# EAGLE design THS788_carrier (EAGLE 9.1.2)
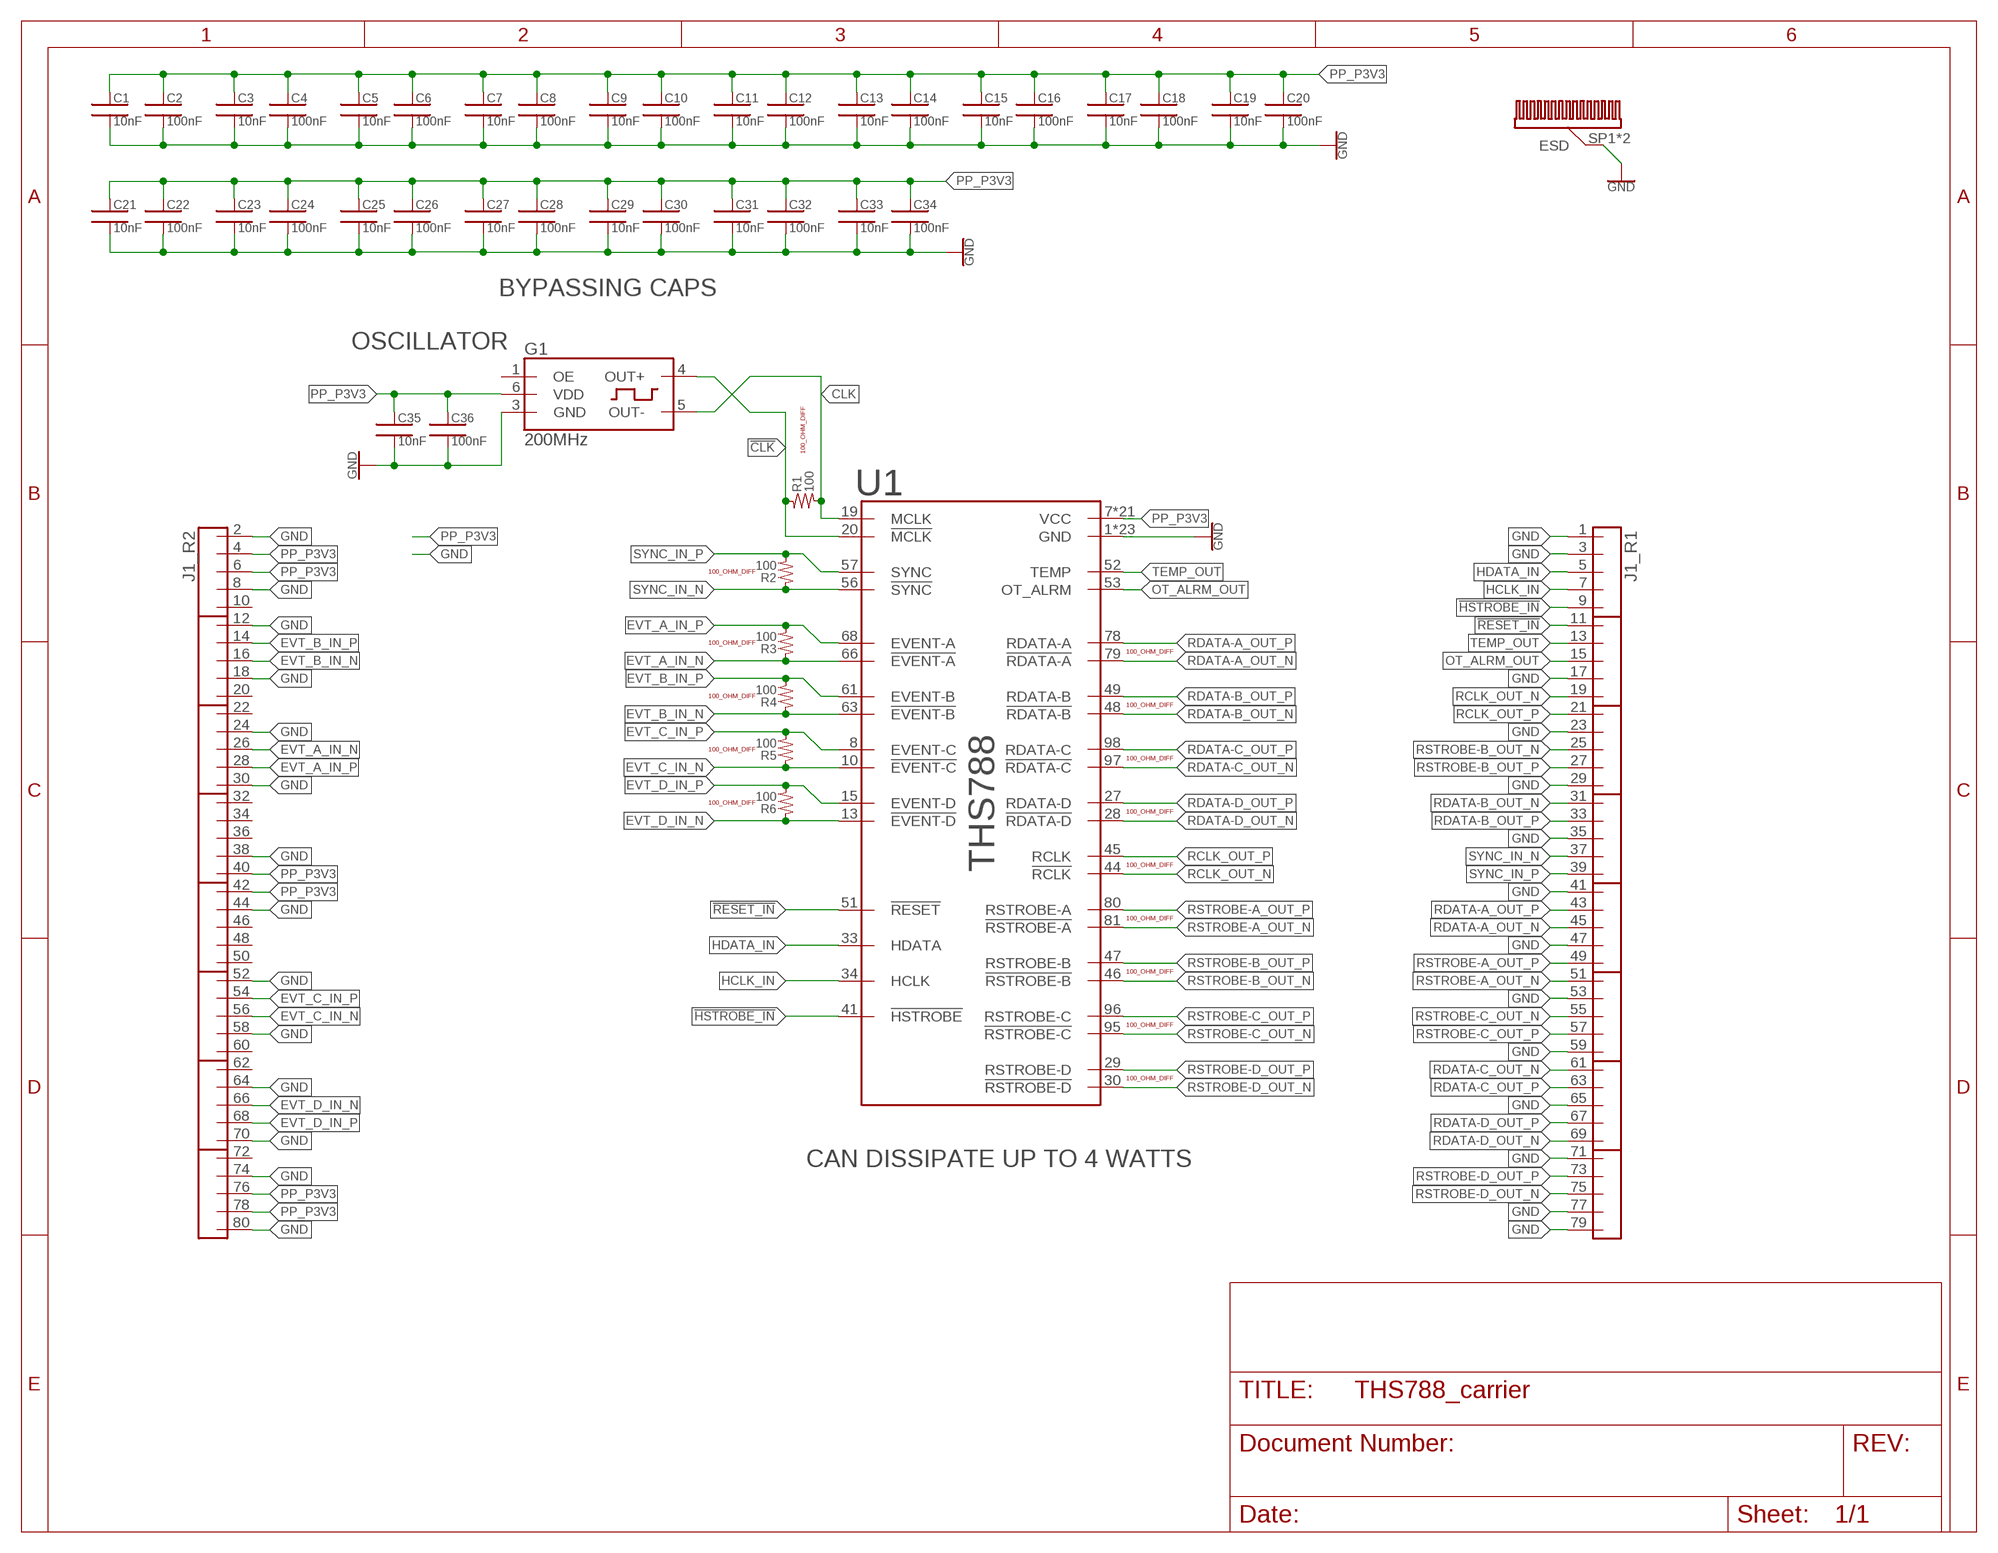
[diagram p0: schematic, sheet 1]

## Parts
C1  10nF  CAP_0402  [0402]
C2  100nF  CAP_0402  [0402]
C3  10nF  CAP_0402  [0402]
C4  100nF  CAP_0402  [0402]
C5  10nF  CAP_0402  [0402]
C6  100nF  CAP_0402  [0402]
C7  10nF  CAP_0402  [0402]
C8  100nF  CAP_0402  [0402]
C9  10nF  CAP_0402  [0402]
C10  100nF  CAP_0402  [0402]
C11  10nF  CAP_0402  [0402]
C12  100nF  CAP_0402  [0402]
C13  10nF  CAP_0402  [0402]
C14  100nF  CAP_0402  [0402]
C15  10nF  CAP_0402  [0402]
C16  100nF  CAP_0402  [0402]
C17  10nF  CAP_0402  [0402]
C18  100nF  CAP_0402  [0402]
C19  10nF  CAP_0402  [0402]
C20  100nF  CAP_0402  [0402]
C21  10nF  CAP_0402  [0402]
C22  100nF  CAP_0402  [0402]
C23  10nF  CAP_0402  [0402]
C24  100nF  CAP_0402  [0402]
C25  10nF  CAP_0402  [0402]
C26  100nF  CAP_0402  [0402]
C27  10nF  CAP_0402  [0402]
C28  100nF  CAP_0402  [0402]
C29  10nF  CAP_0402  [0402]
C30  100nF  CAP_0402  [0402]
C31  10nF  CAP_0402  [0402]
C32  100nF  CAP_0402  [0402]
C33  10nF  CAP_0402  [0402]
C34  100nF  CAP_0402  [0402]
C35  10nF  CAP_0402  [0402]
C36  100nF  CAP_0402  [0402]
G1  200MHz  SIT5021  [SIT5021_5X3.2]
HTSINK1  ATS_HEATSINK  [ATS-FPX025025010-43-C2-R0]
J1  BXE-040-01-F-D-A_BSE  [BSE-040-01-F-D-A]
R1  100  RES_0402  [0402]
R2  100  RES_0402  [0402]
R3  100  RES_0402  [0402]
R4  100  RES_0402  [0402]
R5  100  RES_0402  [0402]
R6  100  RES_0402  [0402]
U1  THS788  [S-QFP-G100]

## Nets
!CLK!: G1.4(OUT+) R1.1 U1.20(!MCLK)
!HSTROBE_IN: J1.9(_R1:P5) U1.41(!HSTROBE)
!RESET_IN: J1.11(_R1:P6) U1.51(!RESET)
CLK: G1.5(OUT-) R1.2 U1.19(MCLK)
EVT_A_IN_N [100_OHM_DIFF]: J1.26(_R2:P13) R3.1 U1.66(!EVENT-A)
EVT_A_IN_P [100_OHM_DIFF]: J1.28(_R2:P14) R3.2 U1.68(EVENT-A)
EVT_B_IN_N [100_OHM_DIFF]: J1.16(_R2:P8) R4.1 U1.63(!EVENT-B)
EVT_B_IN_P [100_OHM_DIFF]: J1.14(_R2:P7) R4.2 U1.61(EVENT-B)
EVT_C_IN_N [100_OHM_DIFF]: J1.56(_R2:P28) R5.1 U1.10(!EVENT-C)
EVT_C_IN_P [100_OHM_DIFF]: J1.54(_R2:P27) R5.2 U1.8(EVENT-C)
EVT_D_IN_N [100_OHM_DIFF]: J1.66(_R2:P33) R6.1 U1.13(!EVENT-D)
EVT_D_IN_P [100_OHM_DIFF]: J1.68(_R2:P34) R6.2 U1.15(EVENT-D)
GND: C1.2 C2.2 C3.2 C4.2 C5.2 C6.2 C7.2 C8.2 C9.2 C10.2 C11.2 C12.2 C13.2 C14.2 C15.2 C16.2 C17.2 C18.2 C19.2 C20.2 C21.2 C22.2 C23.2 C24.2 C25.2 C26.2 C27.2 C28.2 C29.2 C30.2 C31.2 C32.2 C33.2 C34.2 C35.2 C36.2 G1.3(GND) HTSINK1.SP1(ESD) HTSINK1.SP2(ESD) J1.1(_R1:P1) J1.2(_R2:P1) J1.3(_R1:P2) J1.8(_R2:P4) J1.12(_R2:P6) J1.17(_R1:P9) J1.18(_R2:P9) J1.23(_R1:P12) J1.24(_R2:P12) J1.29(_R1:P15) J1.30(_R2:P15) J1.35(_R1:P18) J1.38(_R2:P19) J1.41(_R1:P21) J1.44(_R2:P22) J1.47(_R1:P24) J1.52(_R2:P26) J1.53(_R1:P27) J1.58(_R2:P29) J1.59(_R1:P30) J1.64(_R2:P32) J1.65(_R1:P33) J1.70(_R2:P35) J1.71(_R1:P36) J1.74(_R2:P37) J1.77(_R1:P39) J1.79(_R1:P40) J1.80(_R2:P40) U1.1(GND) U1.2(GND) U1.11(GND) U1.12(GND) U1.21(GND) U1.25(GND) U1.32(GND) U1.35(GND) U1.37(GND) U1.39(GND) U1.42(GND) U1.55(GND) U1.64(GND) U1.65(GND) U1.74(GND) U1.75(GND) U1.82(GND) U1.84(GND) U1.85(GND) U1.87(GND) U1.89(GND) U1.92(GND) U1.94(GND)
HCLK_IN: J1.7(_R1:P4) U1.34(HCLK)
HDATA_IN: J1.5(_R1:P3) U1.33(HDATA)
OT_ALRM_OUT: J1.15(_R1:P8) U1.53(OT_ALRM)
PP_P3V3: C1.1 C2.1 C3.1 C4.1 C5.1 C6.1 C7.1 C8.1 C9.1 C10.1 C11.1 C12.1 C13.1 C14.1 C15.1 C16.1 C17.1 C18.1 C19.1 C20.1 C21.1 C22.1 C23.1 C24.1 C25.1 C26.1 C27.1 C28.1 C29.1 C30.1 C31.1 C32.1 C33.1 C34.1 C35.1 C36.1 G1.6(VDD) J1.4(_R2:P2) J1.6(_R2:P3) J1.40(_R2:P20) J1.42(_R2:P21) J1.76(_R2:P38) J1.78(_R2:P39) U1.7(VCC) U1.16(VCC) U1.22(VCC) U1.23(VCC) U1.24(VCC) U1.31(VCC) U1.36(VCC) U1.38(VCC) U1.40(VCC) U1.43(VCC) U1.58(VCC) U1.60(VCC) U1.69(VCC) U1.77(VCC) U1.83(VCC) U1.86(VCC) U1.88(VCC) U1.90(VCC) U1.91(VCC) U1.93(VCC) U1.99(VCC)
RCLK_OUT_N [100_OHM_DIFF]: J1.19(_R1:P10) U1.44(!RCLK)
RCLK_OUT_P [100_OHM_DIFF]: J1.21(_R1:P11) U1.45(RCLK)
RDATA-A_OUT_N [100_OHM_DIFF]: J1.45(_R1:P23) U1.79(!RDATA-A)
RDATA-A_OUT_P [100_OHM_DIFF]: J1.43(_R1:P22) U1.78(RDATA-A)
RDATA-B_OUT_N [100_OHM_DIFF]: J1.31(_R1:P16) U1.48(!RDATA-B)
RDATA-B_OUT_P [100_OHM_DIFF]: J1.33(_R1:P17) U1.49(RDATA-B)
RDATA-C_OUT_N [100_OHM_DIFF]: J1.61(_R1:P31) U1.97(!RDATA-C)
RDATA-C_OUT_P [100_OHM_DIFF]: J1.63(_R1:P32) U1.98(RDATA-C)
RDATA-D_OUT_N [100_OHM_DIFF]: J1.69(_R1:P35) U1.28(!RDATA-D)
RDATA-D_OUT_P [100_OHM_DIFF]: J1.67(_R1:P34) U1.27(RDATA-D)
RSTROBE-A_OUT_N [100_OHM_DIFF]: J1.51(_R1:P26) U1.81(!RSTROBE-A)
RSTROBE-A_OUT_P [100_OHM_DIFF]: J1.49(_R1:P25) U1.80(RSTROBE-A)
RSTROBE-B_OUT_N [100_OHM_DIFF]: J1.25(_R1:P13) U1.46(!RSTROBE-B)
RSTROBE-B_OUT_P [100_OHM_DIFF]: J1.27(_R1:P14) U1.47(RSTROBE-B)
RSTROBE-C_OUT_N [100_OHM_DIFF]: J1.55(_R1:P28) U1.95(!RSTROBE-C)
RSTROBE-C_OUT_P [100_OHM_DIFF]: J1.57(_R1:P29) U1.96(RSTROBE-C)
RSTROBE-D_OUT_N [100_OHM_DIFF]: J1.75(_R1:P38) U1.30(!RSTROBE-D)
RSTROBE-D_OUT_P [100_OHM_DIFF]: J1.73(_R1:P37) U1.29(RSTROBE-D)
SYNC_IN_N [100_OHM_DIFF]: J1.37(_R1:P19) R2.1 U1.56(!SYNC)
SYNC_IN_P [100_OHM_DIFF]: J1.39(_R1:P20) R2.2 U1.57(SYNC)
TEMP_OUT: J1.13(_R1:P7) U1.52(TEMP)
Unconnected: G1.1(OE) J1.10(_R2:P5) J1.20(_R2:P10) J1.22(_R2:P11) J1.32(_R2:P16) J1.34(_R2:P17) J1.36(_R2:P18) J1.46(_R2:P23) J1.48(_R2:P24) J1.50(_R2:P25) J1.60(_R2:P30) J1.62(_R2:P31) J1.72(_R2:P36)

## Notes on the sheet
- BYPASSING CAPS
- OSCILLATOR
- 100_OHM_DIFF
- 100_OHM_DIFF
- 100_OHM_DIFF
- 100_OHM_DIFF
- 100_OHM_DIFF
- 100_OHM_DIFF
- 100_OHM_DIFF
- 100_OHM_DIFF
- 100_OHM_DIFF
- 100_OHM_DIFF
- 100_OHM_DIFF
- 100_OHM_DIFF
- 100_OHM_DIFF
- 100_OHM_DIFF
- 100_OHM_DIFF
- CAN DISSIPATE UP TO 4 WATTS

## Library data of the parts
C1-C36 = tcspc_lib:CAP
G1 = tcspc_lib:SIT5021: SiT5021 Oscillator 1-220 MHz High Performance Differential (VC) TCXO https://www.digikey.com/product-detail/en/sitime/SIT5021AC-2CE-33E-200.000000X/1473-30172-1-ND/7347769
HTSINK1 = tcspc_lib:ATS_HEATSINK
J1 = tcspc_lib:BXE-040-01-F-D-A
R1-R6 = tcspc_lib:RES
U1 = tcspc_lib:THS788: THS788 Quad-Channel Time Measurement Unit http://www.ti.com/lit/ds/symlink/ths788.pdf

## Net classes
1 50_OHM_SE: width 0.203 mm
2 100_OHM_DIFF: width 0.152 mm, clearance 0.29 mm

## Board
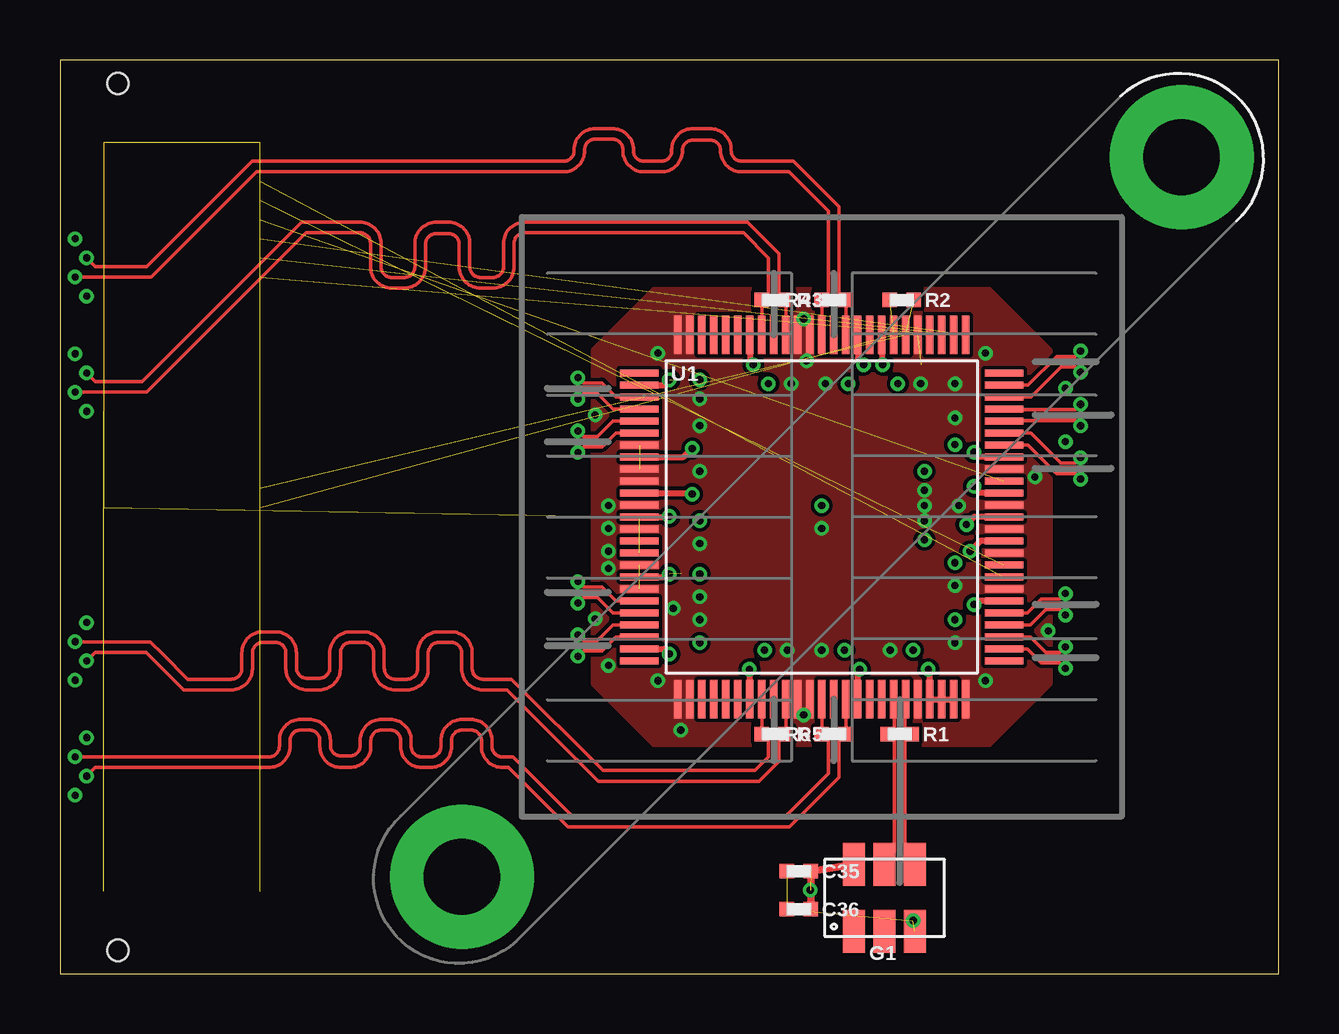
[diagram p1: board, top side]
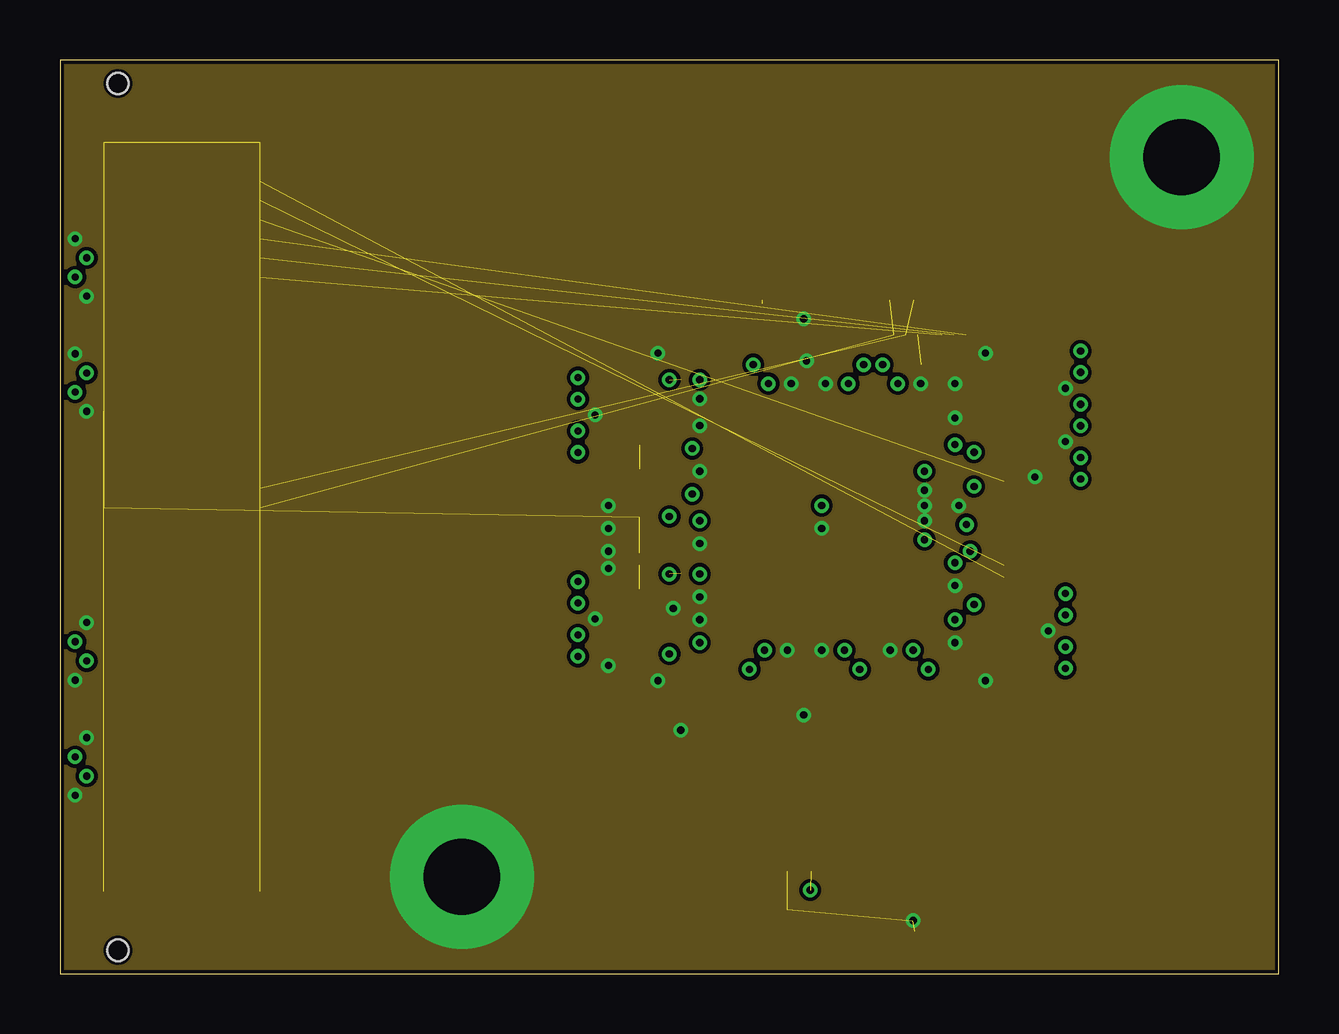
[diagram p2: board, inner layer Route2]
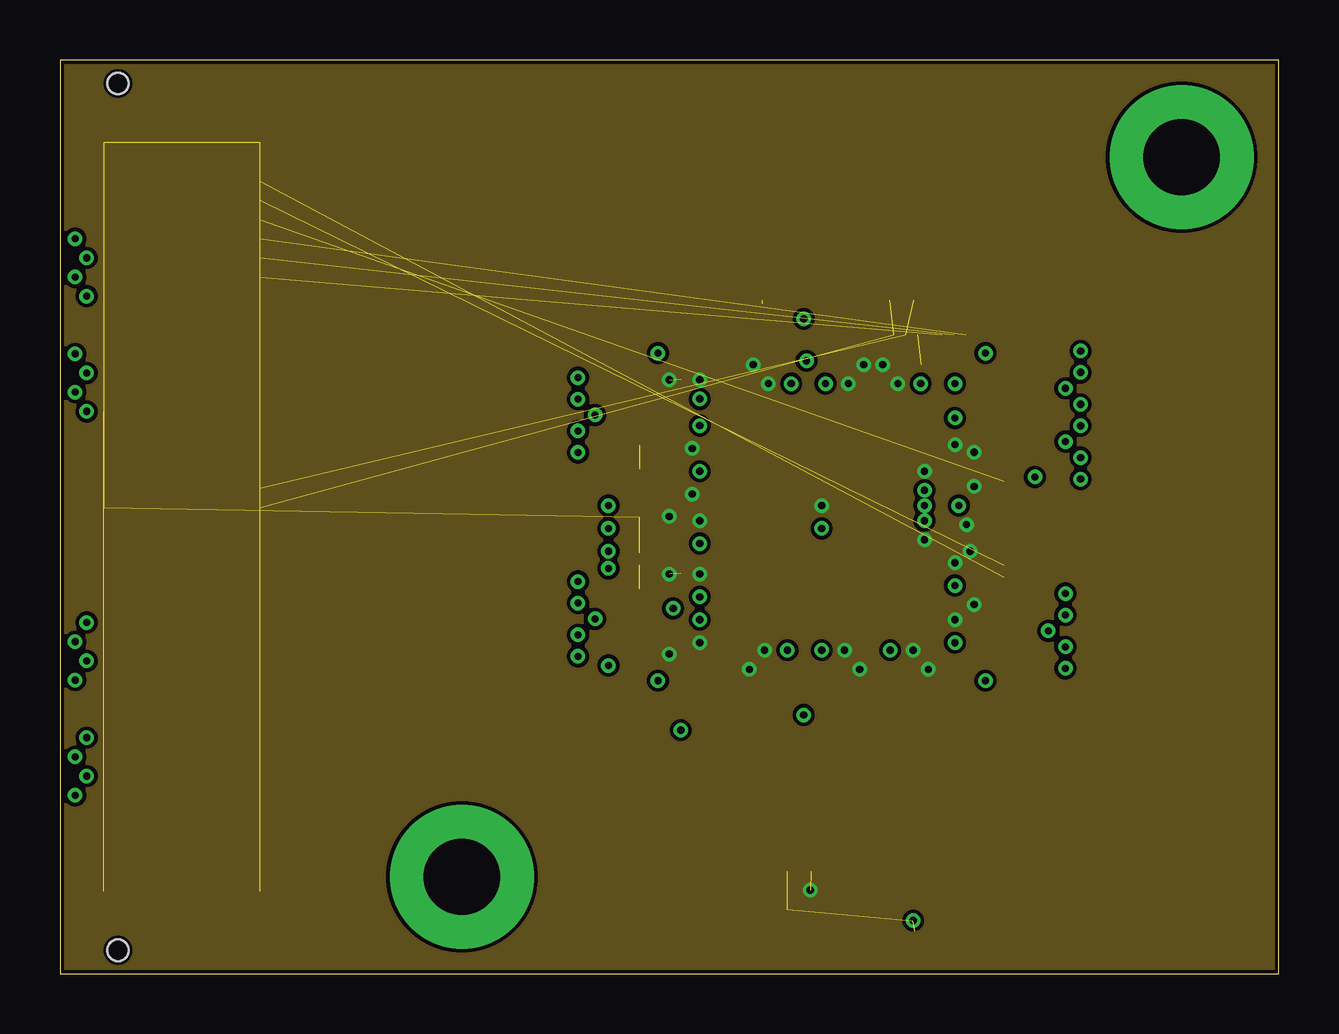
[diagram p3: board, inner layer Route15]
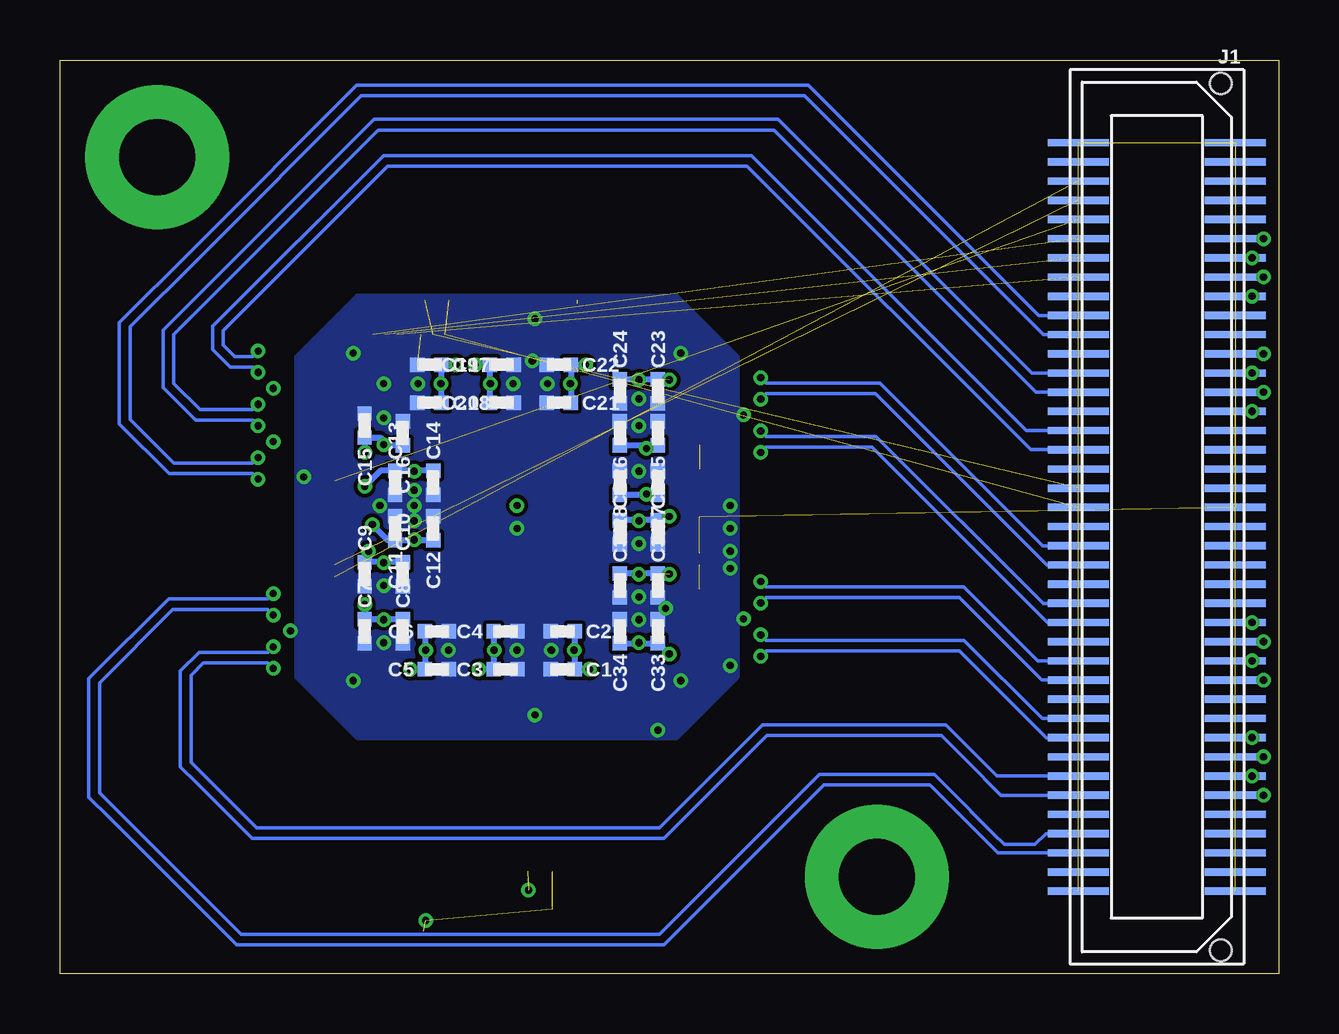
[diagram p4: board, bottom side, seen from below]

Size 50.8 x 38.1 mm. Coordinates in mm from the lower left corner, seen from the top.
Outline: 0,0 50.8,0 50.8,38.1 0,38.1 0,0
Copper layers (1+2*15+16): Top 0.035mm / dielectric 1.5mm / Route2 0.035mm / dielectric 0.15mm / Route15 0.035mm / dielectric 0.2mm / Bottom 0.035mm
Design rules "3PCB_4layer": minimum track width 6mil, minimum drill 0.3mm, track to track 6mil, track to pad 6mil, pad to pad 6mil, via to via 6mil, smd to smd 0mil, copper to edge 6mil, drill to drill 6mil, minimum pad ring 6mil, minimum via ring 6mil, stop-mask expansion 2mil, vias tented up to drill 0.3mm, thermal gap 10mil

### Footprints (pad centres in the part's own frame; a part is rotated, then mirrored left to right if it is on the bottom)
0402 = smd 0.6 x 0.6: 1 -0.5,0; 2 0.5,0
SIT5021_5X3.2 = smd 0.9 x 1.8: 1 -1.27,-1.4; 2 0,-1.4; 3 1.27,-1.4; 4 1.27,1.4; 5 0,1.4; 6 -1.27,1.4
ATS-FPX025025010-43-C2-R0 = drill 3.175 pad 6: SP1 -15,-15; SP2 15,15
BSE-040-01-F-D-A = smd 0.305 x 2.54: 1 -15.602,-3.264; 2 -15.602,3.264; 3 -14.802,-3.264; 4 -14.802,3.264; 5 -14.002,-3.264; 6 -14.002,3.264; 7 -13.202,-3.264; 8 -13.202,3.264; 9 -12.402,-3.264; 10 -12.402,3.264; 11 -11.601,-3.264; 12 -11.601,3.264; 13 -10.801,-3.264; 14 -10.801,3.264; 15 -10.001,-3.264; 16 -10.001,3.264; 17 -9.201,-3.264; 18 -9.201,3.264; 19 -8.401,-3.264; 20 -8.401,3.264; 21 -7.601,-3.264; 22 -7.601,3.264; 23 -6.801,-3.264; 24 -6.801,3.264; 25 -6.001,-3.264; 26 -6.001,3.264; 27 -5.201,-3.264; 28 -5.201,3.264; 29 -4.401,-3.264; 30 -4.401,3.264; 31 -3.6,-3.264; 32 -3.6,3.264; 33 -2.8,-3.264; 34 -2.8,3.264; 35 -2,-3.264; 36 -2,3.264; 37 -1.2,-3.264; 38 -1.2,3.264; 39 -0.4,-3.264; 40 -0.4,3.264; 41 0.4,-3.264; 42 0.4,3.264; 43 1.2,-3.264; 44 1.2,3.264; 45 2,-3.264; 46 2,3.264; 47 2.8,-3.264; 48 2.8,3.264; 49 3.6,-3.264; 50 3.6,3.264; 51 4.401,-3.264; 52 4.401,3.264; 53 5.201,-3.264; 54 5.201,3.264; 55 6.001,-3.264; 56 6.001,3.264; 57 6.801,-3.264; 58 6.801,3.264; 59 7.601,-3.264; 60 7.601,3.264; 61 8.401,-3.264; 62 8.401,3.264; 63 9.201,-3.264; 64 9.201,3.264; 65 10.001,-3.264; 66 10.001,3.264; 67 10.801,-3.264; 68 10.801,3.264; 69 11.601,-3.264; 70 11.601,3.264; 71 12.402,-3.264; 72 12.402,3.264; 73 13.202,-3.264; 74 13.202,3.264; 75 14.002,-3.264; 76 14.002,3.264; 77 14.802,-3.264; 78 14.802,3.264; 79 15.602,-3.264; 80 15.602,3.264 | hole 0.889: -18.066,2.667; 18.066,2.667
S-QFP-G100 = smd 0.3 x 1.6: 1 -6,-7.6; 2 -5.5,-7.6; 3 -5,-7.6; 4 -4.5,-7.6; 5 -4,-7.6; 6 -3.5,-7.6; 7 -3,-7.6; 8 -2.5,-7.6; 9 -2,-7.6; 10 -1.5,-7.6; 11 -1,-7.6; 12 -0.5,-7.6; 13 0,-7.6; 14 0.5,-7.6; 15 1,-7.6; 16 1.5,-7.6; 17 2,-7.6; 18 2.5,-7.6; 19 3,-7.6; 20 3.5,-7.6; 21 4,-7.6; 22 4.5,-7.6; 23 5,-7.6; 24 5.5,-7.6; 25 6,-7.6; 51 6,7.6; 52 5.5,7.6; 53 5,7.6; 54 4.5,7.6; 55 4,7.6; 56 3.5,7.6; 57 3,7.6; 58 2.5,7.6; 59 2,7.6; 60 1.5,7.6; 61 1,7.6; 62 0.5,7.6; 63 0,7.6; 64 -0.5,7.6; 65 -1,7.6; 66 -1.5,7.6; 67 -2,7.6; 68 -2.5,7.6; 69 -3,7.6; 70 -3.5,7.6; 71 -4,7.6; 72 -4.5,7.6; 73 -5,7.6; 74 -5.5,7.6; 75 -6,7.6 | smd 1.6 x 0.3: 26 7.6,-6; 27 7.6,-5.5; 28 7.6,-5; 29 7.6,-4.5; 30 7.6,-4; 31 7.6,-3.5; 32 7.6,-3; 33 7.6,-2.5; 34 7.6,-2; 35 7.6,-1.5; 36 7.6,-1; 37 7.6,-0.5; 38 7.6,0; 39 7.6,0.5; 40 7.6,1; 41 7.6,1.5; 42 7.6,2; 43 7.6,2.5; 44 7.6,3; 45 7.6,3.5; 46 7.6,4; 47 7.6,4.5; 48 7.6,5; 49 7.6,5.5; 50 7.6,6; 76 -7.6,6; 77 -7.6,5.5; 78 -7.6,5; 79 -7.6,4.5; 80 -7.6,4; 81 -7.6,3.5; 82 -7.6,3; 83 -7.6,2.5; 84 -7.6,2; 85 -7.6,1.5; 86 -7.6,1; 87 -7.6,0.5; 88 -7.6,0; 89 -7.6,-0.5; 90 -7.6,-1; 91 -7.6,-1.5; 92 -7.6,-2; 93 -7.6,-2.5; 94 -7.6,-3; 95 -7.6,-3.5; 96 -7.6,-4; 97 -7.6,-4.5; 98 -7.6,-5; 99 -7.6,-5.5; 100 -7.6,-6

### Placement (x,y rotation side)
C1  29.84,12.7 180 bottom
C2  29.84,14.29 180 bottom
C3  32.23,12.7 0 bottom
C4  32.23,14.29 0 bottom
C5  35.08,12.7 0 bottom
C6  35.08,14.29 0 bottom
C7  38.1,14.29 270 bottom
C8  36.51,14.29 270 bottom
C9  38.1,16.67 270 bottom
C10  36.51,16.67 270 bottom
C11  36.83,18.57 90 bottom
C12  35.24,18.57 90 bottom
C13  36.83,20.48 270 bottom
C14  35.24,20.48 270 bottom
C15  38.1,22.86 90 bottom
C16  36.51,22.54 90 bottom
C17  35.4,25.4 180 bottom
C18  35.4,23.81 180 bottom
C19  32.38,25.4 0 bottom
C20  32.38,23.81 0 bottom
C21  30,23.81 180 bottom
C22  30,25.4 180 bottom
C23  25.88,24.29 270 bottom
C24  27.46,24.29 270 bottom
C25  25.88,22.54 90 bottom
C26  27.46,22.54 90 bottom
C27  25.88,20.48 90 bottom
C28  27.46,20.48 90 bottom
C29  25.88,18.41 270 bottom
C30  27.46,18.41 270 bottom
C31  25.88,16.19 270 bottom
C32  27.46,16.19 270 bottom
C33  25.88,14.29 90 bottom
C34  27.46,14.29 90 bottom
C35  30.8,4.29 180 top
C36  30.8,2.7 180 top
G1  34.37,3.17 0 top
HTSINK1  31.75,19.05 180 top
J1  5.08,19.05 270 bottom
R1  35,10 180 top
R2  35.08,28.1 180 top
R3  29.75,28.1 180 top
R4  32.25,28.1 0 top
R5  29.75,10 180 top
R6  32.25,10 0 top
U1  31.75,19.05 0 top

### Tracks (layer width: path | path; a pad name or v marks a point on that pad's centre or on a via)
!CLK!
  Top 0.152: 35.22,10 35.22,5.08 G1.4 | 35.22,10 35.22,10.16 35.22,10.48 U1.20 | R1.1 35.22,10
!HSTROBE_IN  (1 unrouted)
!RESET_IN  (1 unrouted)
CLK
  Top 0.152: 34.78,10 34.78,10.48 U1.19 | 34.78,10 34.78,5.08 G1.5 | R1.2 34.78,10
EVT_A_IN_N  (via drill 0.3)
  Top 0.152: U1.66 R3.1 29.97,28.38 29.97,28.89 29.97,30.03 28.67,31.34 19.37,31.34 arc90 18.49,30.46 18.49,29.47 arc-90 18.05,29.03 17.52,29.03 arc-90 17.08,29.47 17.08,30.46 arc90 16.2,31.34 15.67,31.34 arc90 14.79,30.46 14.79,29.47 arc-90 14.35,29.03 13.82,29.03 arc-90 13.39,29.47 13.39,30.46 arc90 12.51,31.34 10.07,31.34 3.43,24.69 1.47,24.69 v1.11,25.05
  Bottom 0.152: J1.26 v1.11,25.05
EVT_A_IN_P  (via drill 0.3)  (1 unrouted)
  Top 0.152: U1.68 29.25,27.94 | R3.2 29.53,28.38 29.53,28.89 29.53,29.85 28.48,30.89 19.37,30.89 arc90 18.93,30.46 18.93,29.47 arc-90 18.05,28.59 17.52,28.59 arc-90 16.64,29.47 16.64,30.42 arc90 16.2,30.86 15.67,30.86 arc90 15.23,30.42 15.23,29.47 arc-90 14.35,28.59 13.82,28.59 arc-90 12.94,29.47 12.94,30.46 arc90 12.51,30.89 10.25,30.89 3.61,24.25 v0.64,24.25
  Bottom 0.152: v0.64,24.25 J1.28
EVT_B_IN_N  (via drill 0.3)
  Top 0.152: U1.63 R4.1 32.03,28.38 32.03,28.89 32.03,31.79 30.39,33.43 28.42,33.43 arc-90 27.54,34.31 27.54,34.32 arc90 27.1,34.76 26.38,34.76 arc90 25.94,34.32 25.94,34.31 arc-90 25.06,33.43 24.34,33.43 arc-90 23.46,34.31 23.46,34.36 arc90 23.02,34.8 22.31,34.8 arc90 21.87,34.36 21.87,34.31 arc-90 20.99,33.43 8.19,33.43 3.81,29.05 v0.64,29.05
  Bottom 0.152: v0.64,29.05 J1.16
EVT_B_IN_P  (via drill 0.3)
  Top 0.152: U1.61 R4.2 32.47,28.38 32.47,28.89 | 32.47,28.89 32.47,31.98 30.57,33.88 28.42,33.88 arc-90 27.98,34.31 27.98,34.36 arc90 27.1,35.24 26.38,35.24 arc90 25.5,34.36 25.5,34.31 arc-90 25.06,33.88 24.34,33.88 arc-90 23.91,34.31 23.91,34.36 arc90 23.02,35.24 22.31,35.24 arc90 21.43,34.36 21.43,34.31 arc-90 20.99,33.88 8.01,33.88 3.62,29.49 1.47,29.49 v1.11,29.85 | 32.47,28.89
  Bottom 0.152: v1.11,29.85 J1.14
EVT_C_IN_N  (via drill 0.3)
  Top 0.152: U1.10 R5.1 29.97,9.72 29.97,8.86 29.14,8.03 22.45,8.03 18.64,11.84 17.62,11.84 arc-90 16.74,12.72 16.74,13.38 arc90 16.3,13.82 15.79,13.82 arc90 15.35,13.38 15.35,12.72 arc-90 14.47,11.84 13.96,11.84 arc-90 13.08,12.72 13.08,13.38 arc90 12.64,13.82 12.13,13.82 arc90 11.69,13.38 11.69,12.72 arc-90 10.81,11.84 10.29,11.84 arc-90 9.41,12.72 9.41,13.38 arc90 8.98,13.82 8.46,13.82 arc90 8.03,13.38 8.03,12.72 arc-90 7.14,11.84 5.15,11.84 3.58,13.41 2.54,13.41 1.47,13.41 v1.11,13.05
  Bottom 0.152: v1.11,13.05 J1.56
EVT_C_IN_P  (via drill 0.3)
  Top 0.152: U1.8 R5.2 29.53,9.72 29.53,9.04 28.96,8.48 22.63,8.48 18.82,12.29 17.62,12.29 arc-90 17.18,12.72 17.18,13.38 arc90 16.3,14.26 15.79,14.26 arc90 14.91,13.38 14.91,12.72 arc-90 14.47,12.29 13.96,12.29 arc-90 13.52,12.72 13.52,13.38 arc90 12.64,14.26 12.13,14.26 arc90 11.25,13.38 11.25,12.76 arc-90 10.81,12.32 10.29,12.32 arc-90 9.86,12.76 9.86,13.38 arc90 8.98,14.26 8.46,14.26 arc90 7.58,13.38 7.58,12.72 arc-90 7.14,12.29 5.33,12.29 4.28,13.33 3.77,13.85 v0.64,13.85
  Bottom 0.152: v0.64,13.85 J1.54
EVT_D_IN_N  (via drill 0.3)
  Top 0.152: U1.13 R6.1 32.03,9.72 32.03,8.37 30.23,6.57 21.36,6.57 18.89,9.05 18.45,9.05 arc-90 18.01,9.49 18.01,9.73 arc90 17.13,10.61 16.76,10.61 arc90 15.88,9.73 15.88,9.49 arc-90 15.44,9.05 15.08,9.05 arc-90 14.64,9.49 14.64,9.73 arc90 13.76,10.61 13.39,10.61 arc90 12.52,9.73 12.52,9.52 arc-90 12.08,9.09 11.71,9.09 arc-90 11.27,9.52 11.27,9.73 arc90 10.39,10.61 10.03,10.61 arc90 9.15,9.73 9.15,9.49 arc-90 8.71,9.05 v0.64,9.05
  Bottom 0.152: v0.64,9.05 J1.66
EVT_D_IN_P  (via drill 0.3)
  Top 0.152: U1.15 R6.2 32.47,9.72 32.47,8.19 30.41,6.13 21.18,6.13 18.7,8.61 18.45,8.61 arc-90 17.57,9.49 17.57,9.73 arc90 17.13,10.17 16.76,10.17 arc90 16.32,9.73 16.32,9.49 arc-90 15.44,8.61 15.08,8.61 arc-90 14.2,9.49 14.2,9.73 arc90 13.76,10.17 13.39,10.17 arc90 12.96,9.73 12.96,9.49 arc-90 12.08,8.61 11.71,8.61 arc-90 10.83,9.49 10.83,9.73 arc90 10.39,10.17 10.03,10.17 arc90 9.59,9.73 9.59,9.49 arc-90 8.71,8.61 1.47,8.61 v1.11,8.25
  Bottom 0.152: v1.11,8.25 J1.68
GND  (via drill 0.3)  (26 unrouted)
  Bottom 0.152: J1.64 v1.11,9.85 | J1.70 v0.64,7.45 | J1.58 v0.64,12.25 | J1.52 v1.11,14.65 | J1.30 v1.11,23.45 | J1.24 v0.64,25.85 | J1.12 v0.64,30.65 | J1.18 v1.11,28.25
  other vias: 31.75,18.57 37.47,19.53 36.04,19.53 36.04,18.89 36.04,20.16 37.31,16.19 37.31,23.18 35.88,24.61 38.58,25.88 38.58,12.22 24.92,12.22 24.92,25.88 37.31,24.61 31.91,24.61 30.48,24.61 26.67,22.86 26.67,23.97 26.67,20.95 26.67,17.94 25.56,15.24 26.67,15.72 26.67,14.76 31.11,25.56 31,27.3 40.64,20.72 37.31,13.81 34.61,13.49 31.75,13.49 30.32,13.49 31,10.79 25.88,10.16 22.86,16.91 22.86,17.62 22.86,19.53 22.86,18.57 35.56,2.22 22.86,12.86 22.3,14.8 22.3,23.3 41.91,22.19 41.2,14.3 41.91,24.41
  pour Top (no thermals): 22.23,12.06 22.23,26.04 24.77,28.57 38.73,28.57 41.27,26.04 41.27,12.06 38.73,9.53 24.77,9.53
  pour Bottom (no thermals): 22.54,12.38 22.54,25.72 25.08,28.26 38.42,28.26 40.96,25.72 40.96,12.38 38.42,9.84 25.08,9.84
  pour Route2: -1.27,52.07 52.07,52.07 52.07,-1.27 -1.27,-1.27
HCLK_IN  (1 unrouted)
HDATA_IN  (1 unrouted)
OT_ALRM_OUT  (1 unrouted)
PP_P3V3  (via drill 0.3, 0.3 pad 0.2)  (11 unrouted)
  Top 0.254: U1.7 28.75,12.68 v28.73,12.7 | U1.16 33.25,12.61 v33.34,12.7 | v36.2,12.7 36.25,12.64 U1.22 U1.23 U1.24 | U1.31 38.25,15.55 v38.1,15.4 | U1.36 38.37,18.05 v37.94,17.62 | U1.38 38.1,19.05 v37.78,18.73 | U1.40 38.37,20.05 v38.1,20.32 | U1.43 38.3,21.55 v38.1,21.75 | U1.58 34.25,25.44 v34.29,25.4 | U1.60 33.25,25.65 v33.5,25.4 | U1.69 28.75,25.54 v28.89,25.4 | U1.77 25.18,24.55 v25.4,24.77 | U1.83 26,21.55 v26.35,21.91 | U1.86 26.3,20.05 v26.35,20 | U1.88 25.38,19.05 v25.4,19.07 | U1.93 25.28,16.55 v25.4,16.67 | U1.99 25.18,13.55 v25.4,13.34
  Top 0.318: G1.6 31.31,4.28 C35.1 C36.1
  Bottom 0.254: C4.1 C3.1 v33.34,12.7 | C2.1 C1.1 v28.73,12.7 | C6.1 C5.1 v36.2,12.7 | v38.1,15.4 C7.1 C8.1 | v37.94,17.62 37.94,17.64 38.1,17.49 C9.1 C10.1 | v37.78,18.73 37.12,18.07 C11.1 C12.1 | v38.1,20.32 37.44,20.98 C13.1 C14.1 | v38.1,21.75 C15.1 37.44,22.36 37.12,22.04 C16.1 | v34.29,25.4 C17.1 C18.1 | v33.5,25.4 C19.1 C20.1 | C21.1 C22.1 v28.89,25.4 | C28.1 26.38,19.98 v26.35,20 26.33,19.98 C27.1 | C25.1 26.22,22.04 v26.35,21.91 26.49,22.04 C26.1 | C24.1 C23.1 | C30.1 C29.1 25.72,19.07 v25.4,19.07 | v25.4,13.34 25.42,13.34 C33.1 C34.1 | C31.1 C32.1
  other vias: 31.75,19.53 36.04,18.1 36.04,20.95 37.31,17.14 37.31,22.07 34.92,24.61 32.86,24.61 29.53,24.61 26.67,13.81 26.67,16.67 26.67,18.89 26.67,24.77 37.31,14.76 35.56,13.49 32.7,13.49 29.37,13.49 31.27,3.49
  pour Route15: -2.54,53.34 -2.54,-2.54 53.34,-2.54 53.34,53.34
RCLK_OUT_N  (via drill 0.3)
  Top 0.152: U1.44 40.34,22.05 | 40.34,22.05 | 40.34,22.05 41.54,20.86 42.32,20.86 v42.55,20.63
  Bottom 0.152: J1.19 9.99,27.45 19.59,37.05 38.43,37.05 45.32,30.16 48.32,27.16 48.32,22.93 46.25,20.86 42.77,20.86 v42.55,20.63
RCLK_OUT_P  (via drill 0.3)
  Top 0.152: U1.45 40.47,22.55 | 40.47,22.55 | 40.47,22.55 41.72,21.3 42.32,21.3 v42.55,21.52
  Bottom 0.152: J1.21 9.82,26.65 19.78,36.61 38.25,36.61 45.01,29.85 47.88,26.98 47.88,23.11 46.07,21.3 42.77,21.3 v42.55,21.52
RDATA-A_OUT_N  (via drill 0.3)
  Top 0.152: U1.79 23.05,23.55 22.41,24.19 21.82,24.19 v21.59,23.96
  Bottom 0.152: v21.59,23.96 21.36,24.19 | J1.45 9.66,17.05 16.8,24.19 21.36,24.19 | 21.36,24.19
RDATA-A_OUT_P  (via drill 0.3)  (1 unrouted)
  Top 0.152: U1.78 23.17,24.05 22.59,24.63 21.82,24.63 v21.59,24.86
  Bottom 0.152: v21.59,24.86 21.36,24.63 16.62,24.63 9.84,17.85 J1.43
RDATA-B_OUT_N  (via drill 0.3)
  Top 0.152: U1.48 40.48,24.05 41.73,25.3 42.32,25.3 v42.55,25.07
  Bottom 0.152: J1.31 10.51,22.65 21.98,34.11 37.32,34.11 44.43,27 44.43,26.02 43.71,25.3 42.77,25.3 v42.55,25.07
RDATA-B_OUT_P  (via drill 0.3)
  Top 0.152: U1.49 40.35,24.55 41.54,25.74 42.32,25.74 v42.55,25.97
  Bottom 0.152: J1.33 10.34,21.85 22.16,33.67 37.13,33.67 | v42.55,25.97 42.77,25.74 43.53,25.74 43.99,26.21 43.99,26.82 37.13,33.67 | 37.13,33.67
RDATA-C_OUT_N  (via drill 0.3)
  Top 0.152: U1.97 23.05,14.55 22.41,13.91 21.82,13.91 v21.59,14.14
  Bottom 0.152: J1.61 9.86,10.65 13.12,13.91 21.36,13.91 v21.59,14.14
RDATA-C_OUT_P  (via drill 0.3)
  Top 0.152: U1.98 23.17,14.05 22.59,13.47 21.82,13.47 v21.59,13.24
  Bottom 0.152: J1.63 9.69,9.85 13.3,13.47 20.44,13.47 21.36,13.47 v21.59,13.24
RDATA-D_OUT_N  (via drill 0.3)
  Top 0.152: U1.28 40.45,14.05 41.09,13.41 41.68,13.41 v41.91,13.64
  Bottom 0.152: J1.69 11.57,7.45 13.02,8.89 14.06,9.94 17.78,9.94 21.34,9.94 24.13,7.15 25.63,5.65 41.75,5.65 42.8,5.65 45.08,7.94 45.78,8.64 45.78,11.75 45.78,12.63 45.01,13.41 42.14,13.41 v41.91,13.64
RDATA-D_OUT_P  (via drill 0.3)
  Top 0.152: U1.27 40.33,13.55 40.91,12.97 41.68,12.97 v41.91,12.74
  Bottom 0.152: J1.67 11.75,8.25 12.7,9.21 13.88,10.38 17.78,10.38 21.52,10.38 24.45,7.46 25.81,6.09 41.75,6.09 42.61,6.09 44.77,8.25 45.34,8.82 45.34,12.45 44.82,12.97 42.14,12.97 v41.91,12.74
RSTROBE-A_OUT_N  (via drill 0.3)
  Top 0.152: U1.81 23.17,22.55 22.59,21.97 21.82,21.97 v21.59,21.74
  Bottom 0.152: v21.59,21.74 21.36,21.97 | J1.51 9.64,14.65 16.96,21.97 21.36,21.97 | 21.36,21.97
RSTROBE-A_OUT_P  (via drill 0.3)  (1 unrouted)
  Top 0.152: U1.80 23.05,23.05 22.41,22.41 21.82,22.41 v21.59,22.64
  Bottom 0.152: v21.59,22.64 21.36,22.41 | J1.49 9.82,15.45 16.78,22.41 21.36,22.41 | 21.36,22.41
RSTROBE-B_OUT_N  (via drill 0.3)
  Top 0.152: U1.46 40.01,23.05 40.03,23.08 41.79,23.08 42.32,23.08 v42.55,22.85
  Bottom 0.152: J1.25 10.29,25.05 20.86,35.62 37.72,35.62 46.5,26.84 46.5,24.43 45.14,23.08 42.77,23.08 v42.55,22.85
RSTROBE-B_OUT_P  (via drill 0.3)
  Top 0.152: U1.47 40.01,23.55 40.03,23.52 41.9,23.52 42.32,23.52 v42.55,23.75
  Bottom 0.152: J1.27 10.12,24.25 21.05,35.18 37.53,35.18 46.05,26.66 46.05,24.62 44.96,23.52 43.21,23.52 42.77,23.52 v42.55,23.75
RSTROBE-C_OUT_N  (via drill 0.3)
  Top 0.152: U1.95 23.17,15.55 22.59,16.13 21.82,16.13 v21.59,16.36
  Bottom 0.152: J1.55 10.04,13.05 13.12,16.13 21.36,16.13 v21.59,16.36
RSTROBE-C_OUT_P  (via drill 0.3)
  Top 0.152: U1.96 23.05,15.05 22.41,15.69 21.82,15.69 v21.59,15.46
  Bottom 0.152: J1.57 9.86,12.25 13.3,15.69 20.63,15.69 21.36,15.69 v21.59,15.46
RSTROBE-D_OUT_N  (via drill 0.3)
  Top 0.152: U1.30 40.33,15.05 40.91,15.63 41.68,15.63 v41.91,15.86
  Bottom 0.152: J1.75 11.71,5.05 14.13,7.46 14.54,7.88 18.41,7.88 18.96,7.88 23.02,3.81 24.93,1.91 25.63,1.21 42.23,1.21 43.43,1.21 48.73,6.51 49.59,7.37 49.59,12.31 46.27,15.63 42.14,15.63 v41.91,15.86
RSTROBE-D_OUT_P  (via drill 0.3)
  Top 0.152: U1.29 40.45,14.55 41.09,15.19 41.68,15.19 v41.91,14.96
  Bottom 0.152: J1.73 9.71,5.85 10.16,5.4 11.44,5.4 11.89,5.85 13.81,7.78 14.36,8.32 18.41,8.32 19.14,8.32 23.33,4.12 25.24,2.22 25.81,1.65 42.23,1.65 43.25,1.65 48.42,6.82 49.15,7.55 49.15,12.13 46.09,15.19 42.14,15.19 v41.91,14.96
SYNC_IN_N  (2 unrouted)
SYNC_IN_P  (2 unrouted)
TEMP_OUT  (1 unrouted)